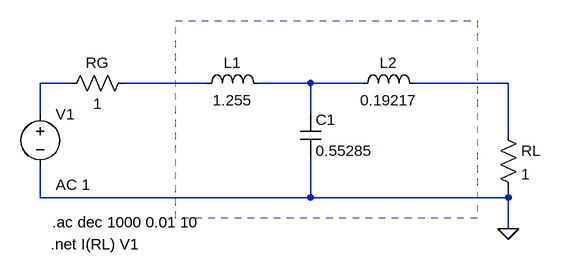
[diagram p0: schematic sim.asc]
sim.asc, the LTspice schematic file:
Version 4
SHEET 1 880 680
WIRE -352 144 -400 144
WIRE -144 144 -272 144
WIRE 16 144 -64 144
WIRE 96 144 16 144
WIRE 320 144 176 144
WIRE -400 192 -400 144
WIRE 16 192 16 144
WIRE 320 224 320 144
WIRE -400 320 -400 272
WIRE 16 320 16 256
WIRE 16 320 -400 320
WIRE 320 320 320 304
WIRE 320 320 16 320
WIRE 320 368 320 320
FLAG 320 368 0
SYMBOL res 304 208 R0
SYMATTR InstName RL
SYMATTR Value 1
SYMBOL voltage -400 176 R0
WINDOW 123 24 124 Left 2
WINDOW 39 0 0 Left 0
SYMATTR InstName V1
SYMATTR Value ""
SYMATTR Value2 AC 1
SYMBOL res -256 128 R90
WINDOW 0 0 56 VBottom 2
WINDOW 3 32 56 VTop 2
SYMATTR InstName RG
SYMATTR Value 1
SYMBOL ind -160 160 R270
WINDOW 0 32 56 VTop 2
WINDOW 3 5 56 VBottom 2
SYMATTR InstName L1
SYMATTR Value 1.255
SYMBOL cap 0 192 R0
SYMATTR InstName C1
SYMATTR Value 0.55285
SYMBOL ind 80 160 R270
WINDOW 0 32 56 VTop 2
WINDOW 3 5 56 VBottom 2
SYMATTR InstName L2
SYMATTR Value 0.19217
TEXT -382 358 Left 2 !.ac dec 1000 0.01 10
TEXT -384 392 Left 2 !.net I(RL) V1
RECTANGLE Normal 272 352 -192 48 2

The netlist it stands for:
* sim.asc
RL N004 0 1
V1 N001 0 AC 1
RG N002 N001 1
L1 N002 N003 1.255
C1 N003 0 0.55285
L2 N003 N004 0.19217
.ac dec 1000 0.01 10
.net I(RL) V1
.backanno
.end